# EAGLE design RollerShutterNode_rfm69 (EAGLE 6.5.0)
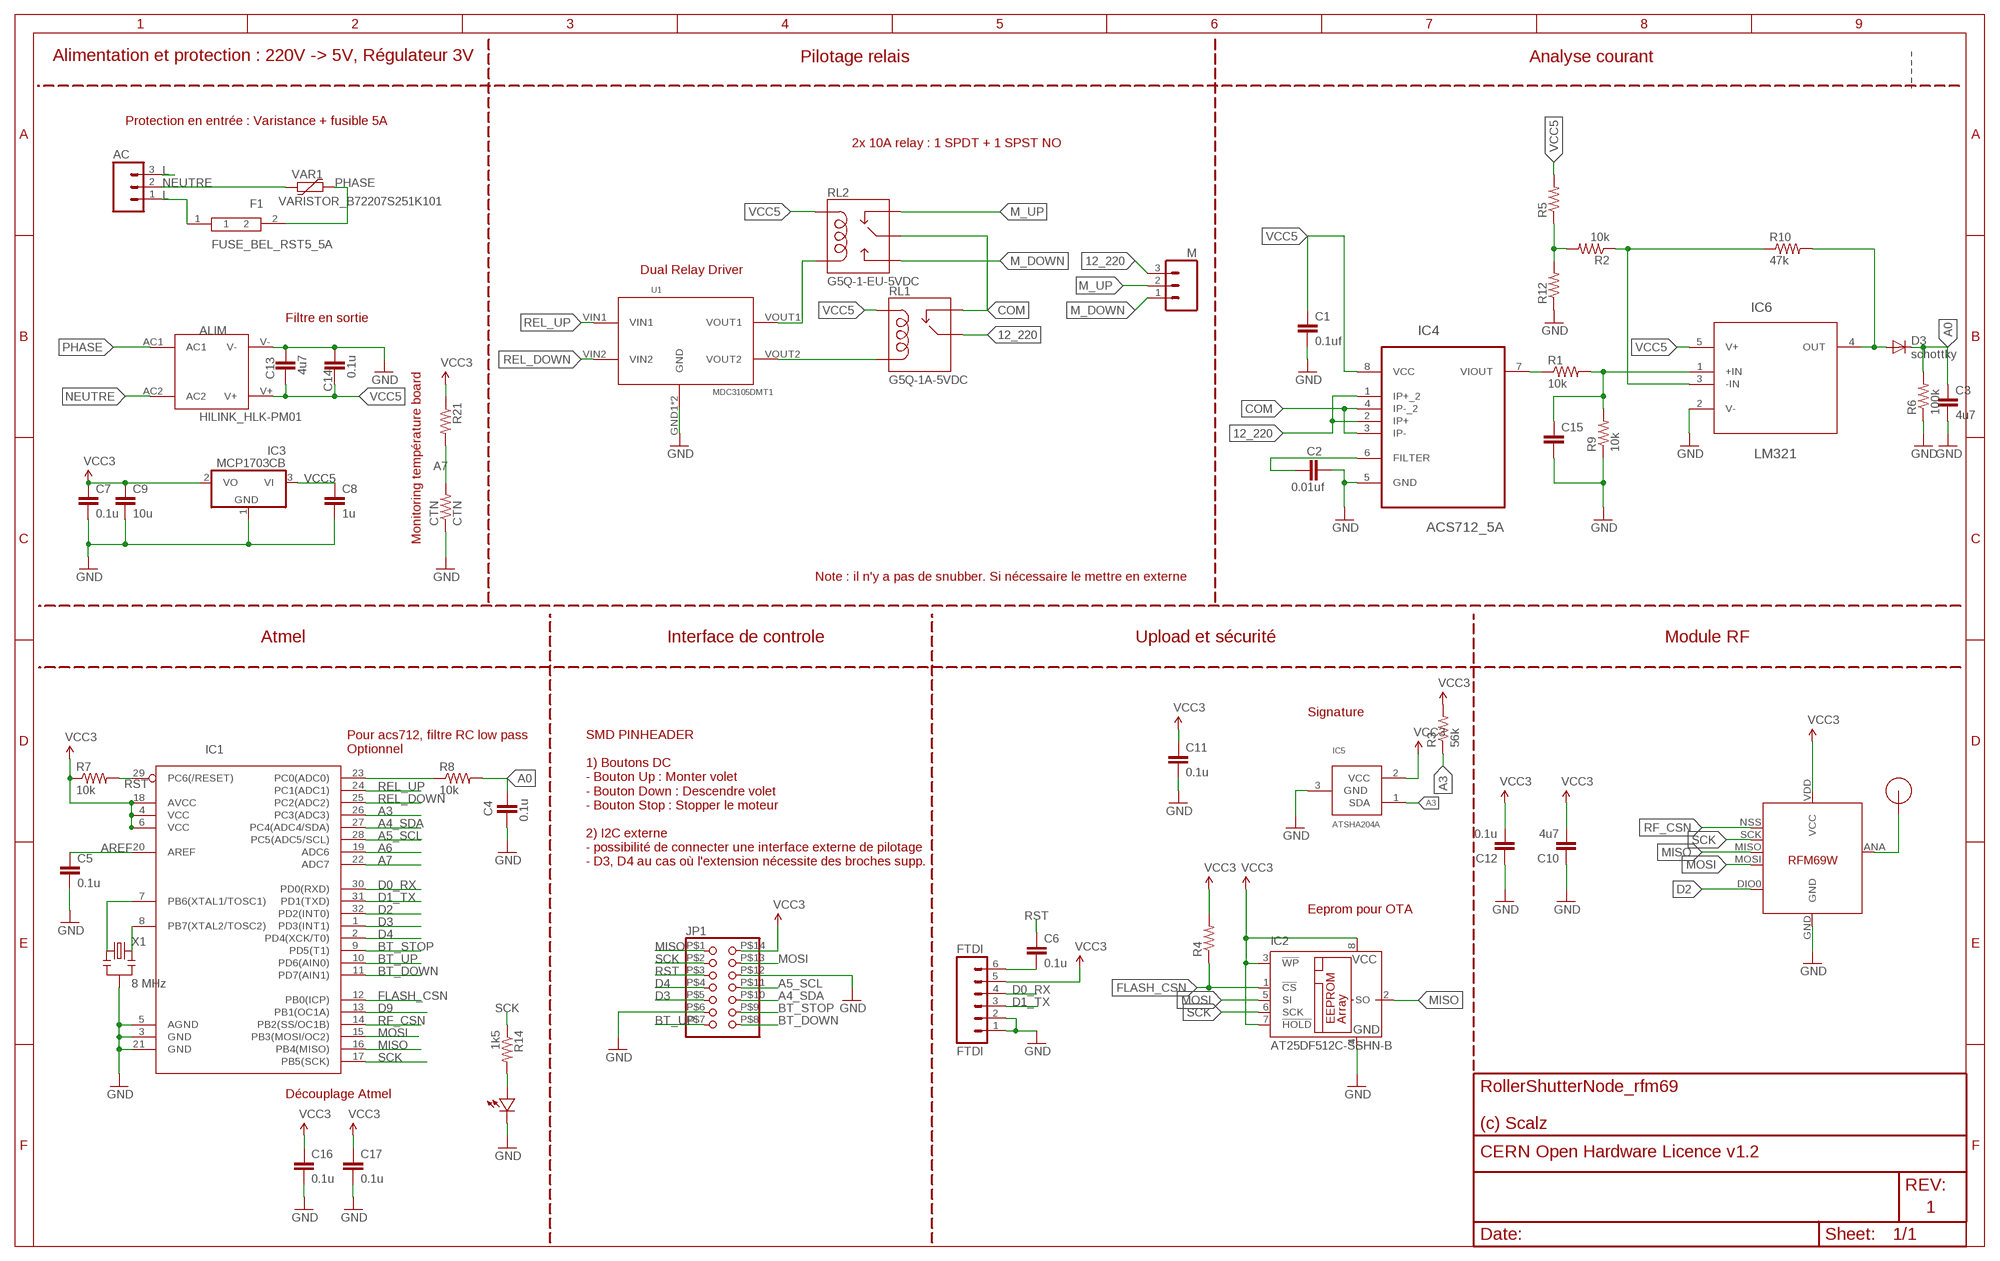
[diagram p0: schematic, sheet 1]

## Parts
AC  M03-SCREW-5MM  [SCREWTERMINAL-5MM-3]
ALIM  HILINK_HLK-PM01  [HILINK_HLK-PM01]
ANT  RFM12B_ANTENNA  [RFM12B-ANTENNA]
C1  0.1uf  CAP0805-CAP  [0805-CAP]
C2  0.01uf  CAP0805-CAP  [0805-CAP]
C3  4u7  CAP0805-CAP  [0805-CAP]
C4  0.1u  CAP0805-CAP  [0805-CAP]
C5  0.1u  CAP0805-CAP  [0805-CAP]
C6  0.1u  CAP0805-CAP  [0805-CAP]
C7  0.1u  CAP0805-CAP  [0805-CAP]
C8  1u  CAP0805-CAP  [0805-CAP]
C9  10u  CAP0805-CAP  [0805-CAP]
C10  4u7  CAP0805-CAP  [0805-CAP]
C11  0.1u  CAP0805-CAP  [0805-CAP]
C12  0.1u  CAP0805-CAP  [0805-CAP]
C13  4u7  CAP0805-CAP  [0805-CAP]
C14  0.1u  CAP0805-CAP  [0805-CAP]
C15  CAP0805-CAP  [0805-CAP]
C16  0.1u  CAP0805-CAP  [0805-CAP]
C17  0.1u  CAP0805-CAP  [0805-CAP]
CTN  CTN  RESISTOR0805-RES  [0805-RES]
D3  schottky  DIODESOD  [SOD-323]
D4  LED0805  [0805-LED]
F1  FUSE_BEL_RST5_5A  [FUSE_BEL_RST5_5A]
FTDI  FTDI  M06SIP  [1X06]
IC1  ATMega-328  ATMEGA168/328TQFP32  [TQFP32-08]
IC2  AT25DF512C-SSHN-B  25AA080SN  [SO-08]
IC3  MCP1703CB  [SOT23]
IC4  ACS712_5A  ACS712ELCTR-20A-T  [SOIC127P600X175-8N]
IC5  ATSHA204A  [SOT23]
IC6  LM321  LM321MF  [SOT95P285X120-5N]
JP1  PINHD-2X7  [2X07]
M  M03-SCREW-5MM  [SCREWTERMINAL-5MM-3]
R1  10k  RESISTOR0805-RES  [0805-RES]
R2  10k  RESISTOR0805-RES  [0805-RES]
R3  56k  RESISTOR0805-RES  [0805-RES]
R4  RESISTOR0805-RES  [0805-RES]
R5  RESISTOR0805-RES  [0805-RES]
R6  100k  RESISTOR0805-RES  [0805-RES]
R7  10k  RESISTOR0805-RES  [0805-RES]
R8  10k  RESISTOR0805-RES  [0805-RES]
R9  10k  RESISTOR0805-RES  [0805-RES]
R10  47k  RESISTOR0805-RES  [0805-RES]
R12  RESISTOR0805-RES  [0805-RES]
R14  1k5  RESISTOR0805-RES  [0805-RES]
R21  RESISTOR0805-RES  [0805-RES]
RFM69  RFM69  [RFM69W-MINPADS]
RL1  G5Q-1A-5VDC  G5Q_SINGLE  [G5Q_SINGLE]
RL2  G5Q-1-EU-5VDC  RELAYPTH  [RELAY-G5Q]
U1  MDC3105DMT1  [MDC3105DMT1]
VAR1  VARISTOR_B72207S251K101  [VARISTOR_B72207S251K101]
X1  8 MHz  RESONATORSMD  [RESONATOR-SMD]

## Nets
12_220: IC4.1(IP+_2) IC4.2(IP+) M.3 RL1.2(MAIN)
A0: C3.1 C4.2 D3.1(C) R6.2 R8.2
A3: IC1.26(PC3(ADC3)) IC5.1(SDA) R3.1
A4_SDA: IC1.27(PC4(ADC4/SDA)) JP1.P$10
A5_SCL: IC1.28(PC5(ADC5/SCL)) JP1.P$11
A6: IC1.19(ADC6)
A7: CTN.2 IC1.22(ADC7) R21.2
AREF: C5.1 IC1.20(AREF)
BT_DOWN: IC1.11(PD7(AIN1)) JP1.P$8
BT_STOP: IC1.9(PD5(T1)) JP1.P$9
BT_UP: IC1.10(PD6(AIN0)) JP1.P$7
COM: IC4.3(IP-) IC4.4(IP-_2) RL1.3(NC) RL2.2(MAIN)
D0_RX: FTDI.4 IC1.30(PD0(RXD))
D1_TX: FTDI.3 IC1.31(PD1(TXD))
D2: IC1.32(PD2(INT0)) RFM69.DIO0
D3: IC1.1(PD3(INT1)) JP1.P$5
D4: IC1.2(PD4(XCK/T0)) JP1.P$4
D9: IC1.13(PB1(OC1A))
FLASH_CSN: IC1.12(PB0(ICP)) IC2.1(!CS) R4.1
GND: ALIM.V- C1.2 C2.2 C3.2 C4.1 C5.2 C7.2 C8.2 C9.2 C10.1 C11.2 C12.1 C13.2 C14.2 C15.2 C16.2 C17.2 CTN.1 D4.MINUS FTDI.1 FTDI.2 IC1.3(GND) IC1.5(AGND) IC1.21(GND) IC2.4(GND) IC3.1(GND) IC4.5(GND) IC5.3(GND) IC6.2(V-) JP1.P$6 JP1.P$12 R6.1 R9.1 R12.1 RFM69.GND U1.GND1(GND) U1.GND2(GND) X1.2
L: AC.1 AC.3 F1.1
LM_OUT: D3.2(A) IC6.4(OUT) R10.2
M_DOWN: M.1 RL2.3(NO)
M_UP: M.2 RL2.4(NC)
MISO: IC1.16(PB4(MISO)) IC2.2(SO) JP1.P$1 RFM69.MISO
MOSI: IC1.15(PB3(MOSI/OC2)) IC2.5(SI) JP1.P$13 RFM69.MOSI
N$1: C2.1 IC4.6(FILTER)
N$3: IC4.7(VIOUT) R1.1
N$4: ANT.P$1 RFM69.ANA(ANT)
N$6: RL1.5(COIL2) U1.VOUT2
N$10: C15.1 IC6.1(+IN) R1.2 R9.2
N$11: IC6.3(-IN) R2.1 R10.1
N$12: IC1.7(PB6(XTAL1/TOSC1)) X1.1
N$16: IC1.23(PC0(ADC0)) R8.1
N$17: D4.PLUS R14.2
N$18: R2.2 R5.1 R12.2
N$19: RL2.1(COIL2) U1.VOUT1
N$20: C6.2 FTDI.6
N$21: IC1.8(PB7(XTAL2/TOSC2)) X1.3
NEUTRE: AC.2 ALIM.AC2 VAR1.1
PHASE: ALIM.AC1 F1.2 VAR1.2
REL_DOWN: IC1.25(PC2(ADC2)) U1.VIN2
REL_UP: IC1.24(PC1(ADC1)) U1.VIN1
RF_CSN: IC1.14(PB2(SS/OC1B)) RFM69.NSS(SEL)
RST: C6.1 IC1.29(PC6(/RESET)) JP1.P$3 R7.2
SCK: IC1.17(PB5(SCK)) IC2.6(SCK) JP1.P$2 R14.1 RFM69.SCK
VCC: C7.1 C9.1 C10.2 C11.1 C12.2 C16.1 C17.1 FTDI.5 IC1.4(VCC) IC1.6(VCC) IC1.18(AVCC) IC2.3(!WP) IC2.7(!HOLD) IC2.8(VCC) IC3.2(VO) IC5.2(VCC) JP1.P$14 R3.2 R4.2 R7.1 R21.1 RFM69.VDD(VCC) ; supply symbol labelled VCC3
VCC5: ALIM.V+ C1.1 C8.1 C13.1 C14.1 IC3.3(VI) IC4.8(VCC) IC6.5(V+) R5.2 RL1.1(COIL1) RL2.5(COIL1)

## Notes on the sheet
- Alimentation et protection : 220V -> 5V, Régulateur 3V | Pilotage relais | Analyse courant
- Protection en entrée : Varistance + fusible 5A
- 2x 10A relay : 1 SPDT + 1 SPST NO
- Dual Relay Driver
- Filtre en sortie
- Monitoring température board
- Note : il n'y a pas de snubber. Si nécessaire le mettre en externe
- Atmel | Interface de controle | Upload et sécurité | Module RF
- Signature
- Pour acs712, filtre RC low pass
  Optionnel
- SMD PINHEADER
  
  1) Boutons DC
  - Bouton Up : Monter volet
  - Bouton Down : Descendre volet
  - Bouton Stop : Stopper le moteur
  
  2) I2C externe
  - possibilité de connecter une interface externe de pilotage
  - D3, D4 au cas où l'extension nécessite des broches supp.
- Eeprom pour OTA
- Découplage Atmel

## Library data of the parts
AC M = SparkFun-Connectors:M03: Header 3 Standard 3-pin 0.1" header. Use with straight break away headers (SKU : PRT-00116), right angle break away headers (PRT-00553), swiss pins (PRT-00743), machine pins (PRT-00117), and female headers (PRT-00115). Molex polarized connector foot print use with SKU : PRT-08232 with associated crimp pins and housings.
ALIM = pmo_lib:HILINK_HLK-PM01
ANT = LowPowerLab:RFM12B_ANTENNA
C1-C17 = LowPowerLab:CAP: Capacitor Standard 0603 ceramic capacitor, and 0.1" leaded capacitor.
CTN R1-R10 R12 R14 R21 = LowPowerLab:RESISTOR: Resistor Basic schematic elements and footprints for 0603, 1206, and PTH resistors.
D3 = SparkFun-DiscreteSemi:DIODE: Diode These are standard reverse protection diodes and small signal diodes. SMA package can handle up to about 1A. SOD-323 can handle about 200mA. What the SOD-323 package when ordering, there are some mfgs out there that are 5-pin packages.; PROD_ID: DIO-09646
D4 = LowPowerLab:LED
F1 = pmo_lib:FUSE_BEL_RST5_5A
FTDI = SparkFun-Connectors:M06: Header 6 Standard 6-pin 0.1" header. Use with straight break away headers (SKU : PRT-00116), right angle break away headers (PRT-00553), swiss pins (PRT-00743), machine pins (PRT-00117), and female headers (PRT-00115). Molex polarized connector foot print use with SKU : PRT-08094 with associated crimp pins and housings. NOTES ON THE VARIANTS LOCK and LOCK_LONGPADS... This footprint was designed to help hold the alignment of a through-hole component (i.e. 6-pin header) while soldering it into place. You may notice that each hole has been shifted either up or down by 0.005 of an inch from it's more standard position (which is a perfectly straight line). This slight alteration caused the pins (the squares in the middle) to touch the edges of the holes. Because they are alternating, it causes a "brace" to hold the component in place. 0.005 has proven to be the perfect amount of "off-center" position when using our standard breakaway headers. Although looks a little odd when you look at the bare footprint, once you have a header in there, the alteration is very hard to notice. Also, if you push a header all the way into place, it is covered up entirely on the bottom side. This idea of altering the position of holes to aid alignment will be further integrated into the Sparkfun Library for other footprints. It can help hold any component with 3 or more connection pins.
IC1 = LowPowerLab:ATMEGA168/328: Atmel 32-pin 8-bit micro, 16k flash.; EAGLEUP: TQFP32-08
IC2 = microchip:25*: Serial EEPROM 4K/ 8K , SPI bus; MF: MICROCHIP; MPN: 25AA080/SN; OC_FARNELL: 1816072; OC_NEWARK: 92C7351
IC3 = linear:MCP1703: 250 mA, 16V, Low Quiescent Current LDO Regulator Source: http://ww1.microchip.com/downloads/en/DeviceDoc/22049b.pdf
IC4 = pmo_lib:ACS712ELCTR-20A-T: Linear Current Sensor; MPN: ACS712ELCTR-20A-T; OC_FARNELL: 1329624; OC_NEWARK: 31M3133; PACKAGE: SOIC-8; SUPPLIER: Allegro
IC5 = Sensor_tbowmo:ATSHA204A
IC6 = pmo_lib:LM321MF: Low Power Single Op Amp; MPN: LM321MF; OC_FARNELL: 9779116; OC_NEWARK: 37K8530; PACKAGE: SOT-23-5; SUPPLIER: National Semiconductors
JP1 = pmo_lib:PINHD-2X7: PIN HEADER
RFM69 = LowPowerLab:RFM69
RL1 = pmo_lib:G5Q_SINGLE
RL2 = pmo_lib:RELAY: SPDT relay (COM-00101)
U1 = pmo_lib:MDC3105DMT1
VAR1 = pmo_lib:VARISTOR_B72207S251K101
X1 = SparkFun:RESONATOR: Resonator Small SMD resonator. This is the itty bitty 10/20MHz resonators with built in caps. CSTCE10M0G55 and CSTCE20M0V53. Footprint has been reviewed closely but hasn't been tested yet.

## Net classes
1 Power: width 0.406 mm

## Board
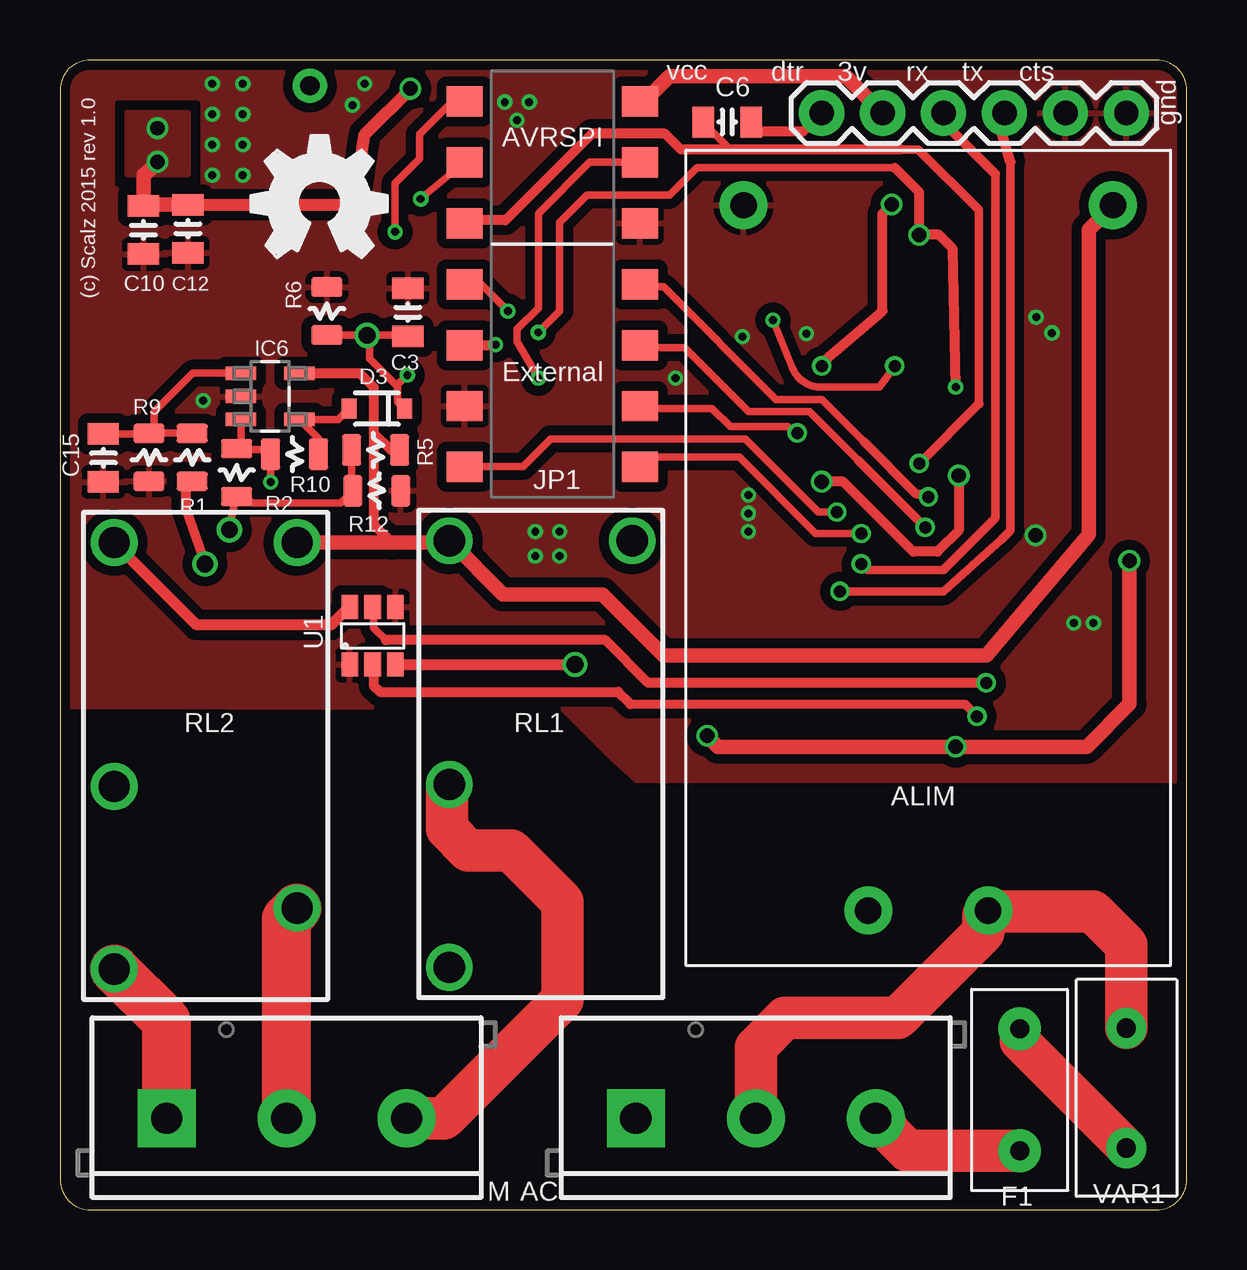
[diagram p1: board, top side]
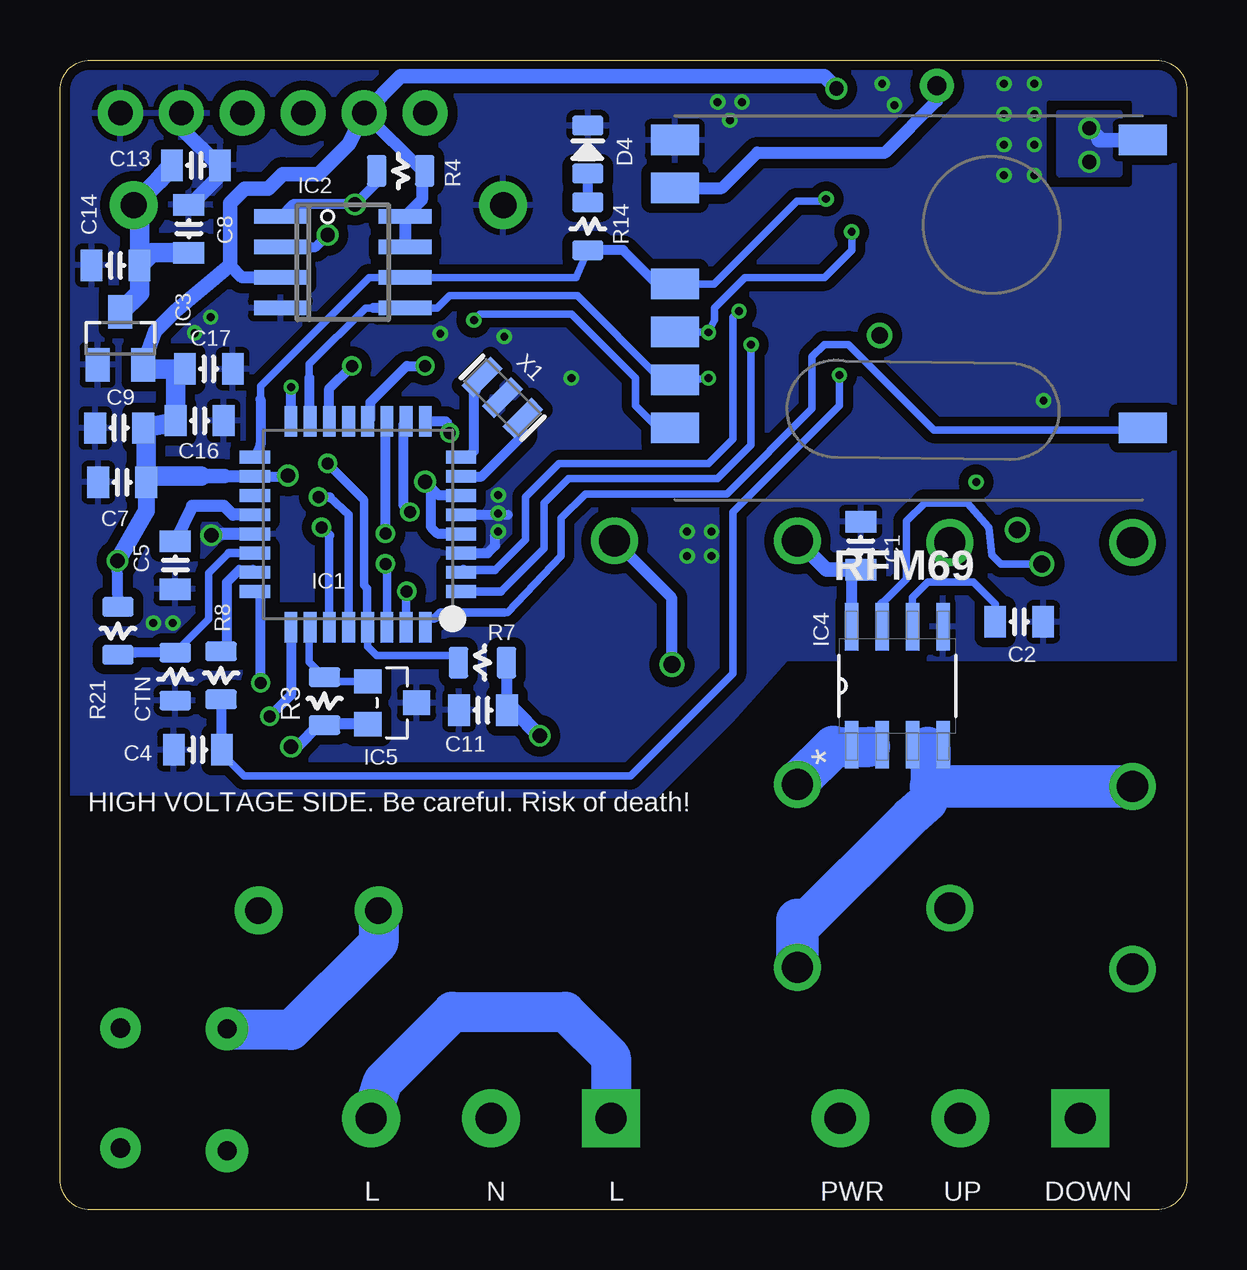
[diagram p2: board, bottom side, seen from below]

Size 46.97 x 47.93 mm. Coordinates in mm from the lower left corner, seen from the top.
Outline: 0,46.66 0,1.27 arc90 1.27,0 45.7,0 arc90 46.97,1.27 46.97,46.66 arc90 45.7,47.93 1.27,47.93 arc90 0,46.66
Copper layers (1*16): Top 0.035mm / dielectric 1.5mm / Bottom 0.035mm
Design rules "dirt_cheap_dirty_boards.v1": minimum track width 5mil, minimum drill 12mil, track to track 5mil, track to pad 5mil, pad to pad 5mil, via to via 5mil, smd to smd 0mil, copper to edge 10mil, drill to drill 10mil, minimum pad ring 10mil, minimum via ring 6mil, stop-mask expansion 2mil, vias tented up to drill 25mil, thermal gap 10mil

### Footprints (pad centres in the part's own frame; a part is rotated, then mirrored left to right if it is on the bottom)
SCREWTERMINAL-5MM-3 = drill 1.3 pad 2.413 square: 1 0,0 | drill 1.3 pad 2.413: 2 5,0; 3 10,0
HILINK_HLK-PM01 = drill 1.1 pad 2: AC1 2.5,14.7; AC2 -2.5,14.7; V+ -7.7,-14.7; V- 7.7,-14.7
RFM12B-ANTENNA = drill 0.8 pad 1.422: P$1 0,0
0805-CAP = smd 0.902 x 1.3: 1 -1,0; 2 1,0
0805-RES = smd 0.8 x 1.3: 1 -1,0; 2 1,0
SOD-323 = smd 0.63 x 0.83: 1 -1.15,0; 2 1.15,0
0805-LED = smd 0.8 x 1.3: MINUS -1,0; PLUS 1,0
FUSE_BEL_RST5_5A = drill 0.8 pad 1.778: 1 -2.54,0; 2 2.54,0
1X06 = drill 1.016 pad 1.88: 1 0,0; 2 2.54,0; 3 5.08,0; 4 7.62,0; 5 10.16,0; 6 12.7,0
TQFP32-08 = smd 1.27 x 0.533: 1 -4.293,2.8; 2 -4.293,2; 3 -4.293,1.2; 4 -4.293,0.4; 5 -4.293,-0.4; 6 -4.293,-1.2; 7 -4.293,-2; 8 -4.293,-2.8; 17 4.293,-2.8; 18 4.293,-2; 19 4.293,-1.2; 20 4.293,-0.4; 21 4.293,0.4; 22 4.293,1.2; 23 4.293,2; 24 4.293,2.8 | smd 0.533 x 1.27: 9 -2.8,-4.293; 10 -2,-4.293; 11 -1.2,-4.293; 12 -0.4,-4.293; 13 0.4,-4.293; 14 1.2,-4.293; 15 2,-4.293; 16 2.8,-4.293; 25 2.8,4.293; 26 2,4.293; 27 1.2,4.293; 28 0.4,4.293; 29 -0.4,4.293; 30 -1.2,4.293; 31 -2,4.293; 32 -2.8,4.293
SO-08 = smd 0.6 x 2.2: 1 -1.905,-2.6; 2 -0.635,-2.6; 3 0.635,-2.6; 4 1.905,-2.6; 5 1.905,2.6; 6 0.635,2.6; 7 -0.635,2.6; 8 -1.905,2.6
SOT23 = smd 1 x 1.4: 1 -0.95,-1.1; 2 0.95,-1.1; 3 0,1.1
SOIC127P600X175-8N = smd 1.981 x 0.559: 1 -2.464,1.905; 2 -2.464,0.635; 3 -2.464,-0.635; 4 -2.464,-1.905; 5 2.464,-1.905; 6 2.464,-0.635; 7 2.464,0.635; 8 2.464,1.905
SOT23' = smd 1.016 x 1.143: 1 -0.889,-1.016; 2 0.889,-1.016; 3 0,1.016
SOT95P285X120-5N = smd 1.27 x 0.559: 1 -1.219,0.965; 2 -1.219,0; 3 -1.219,-0.965; 4 1.219,-0.965; 5 1.219,0.965
2X07 = smd 1.27 x 1.5: P$1 -7.62,-3.65; P$2 -5.08,-3.65; P$3 -2.54,-3.65; P$4 0,-3.65; P$5 2.54,-3.65; P$6 5.08,-3.65; P$7 7.62,-3.65; P$8 7.62,3.65; P$9 5.08,3.65; P$10 2.54,3.65; P$11 0,3.65; P$12 -2.54,3.65; P$13 -5.08,3.65; P$14 -7.62,3.65
RFM69W-MINPADS = smd 2 x 1.27: ANA 8,-5; DIO0 -11.5,5; GND 8,-7; MISO 8,1; MOSI 8,3; NSS 8,5; SCK 8,-1; VDD -11.5,-7
G5Q_SINGLE = drill 1.3: 1 10.16,3.81; 2 0,3.81; 3 -7.62,3.81; 5 10.16,-3.81
RELAY-G5Q = drill 1.3: 1 8.89,3.81; 2 -1.27,3.81; 3 -8.89,3.81; 4 -6.35,-3.81; 5 8.89,-3.81
MDC3105DMT1 = smd 0.7 x 1: GND1 -0.95,-1.2; GND2 0.95,1.2; VIN1 0,1.2; VIN2 0,-1.2; VOUT1 -0.95,1.2; VOUT2 0.95,-1.2
VARISTOR_B72207S251K101 = drill 0.8 pad 1.676: 1 -2.5,0; 2 2.5,0
RESONATOR-SMD = smd 0.7 x 1.7: 1 -1.2,0; 2 0,0; 3 1.2,0

### Placement (x,y rotation side)
AC  24,3.81 0 top
ALIM  36.2,27.18 180 top
ANT  10.41,46.86 0 top
C1  13.59,27.69 90 bottom
C2  6.99,24.51 0 bottom
C3  14.5,37.41 90 top
C4  41.22,19.18 0 bottom
C5  42.16,26.87 270 bottom
C6  27.81,45.34 0 top
C7  44.37,30.33 180 bottom
C8  41.61,40.89 90 bottom
C9  44.5,32.59 180 bottom
C10  3.48,40.84 90 top
C11  29.34,20.83 180 bottom
C12  5.33,40.89 90 top
C13  41.3,43.54 0 bottom
C14  44.65,39.37 180 bottom
C15  1.8,31.34 270 top
C16  41.15,32.89 0 bottom
C17  40.77,35.05 0 bottom
CTN  42.16,22.23 90 bottom
D3  13.21,33.4 180 top
D4  24.97,44.2 270 bottom
F1  40.01,5 90 top
FTDI  44.45,45.72 180 top
IC1  34.54,28.57 180 bottom
IC2  35.18,39.5 270 bottom
IC3  44.45,36.32 0 bottom
IC4  12.06,21.84 90 bottom
IC5  ATSHA204A  [SOT23']  33.12,21.13 270 bottom
IC6  8.76,33.91 0 top
JP1  20.52,38.58 270 top
M  4.45,3.81 0 top
R1  5.51,31.37 90 top
R2  7.37,30.73 270 top
R3  35.94,21.21 270 bottom
R4  32.77,43.31 0 bottom
R5  13.16,31.67 0 top
R6  11.13,37.47 270 top
R7  29.36,22.81 180 bottom
R8  40.26,22.28 270 bottom
R9  3.71,31.37 90 top
R10  9.78,31.5 0 top
R12  13.21,29.97 180 top
R14  24.97,41 90 bottom
R21  44.55,24.13 270 bottom
RFM69  13.34,37.59 180 bottom
RL1  20.04,17.73 90 top
RL2  6.07,18.92 90 top
U1  13.03,23.93 0 top
U$4  [OSHW_FILLX200_NOTEXT]  7.98,39.7 0 top
VAR1  44.45,5.08 270 top
X1  28.52,33.86 135 bottom

### Tracks (layer width: path | path; a pad name or v marks a point on that pad's centre or on a via)
12_220
  Top 1.778: M.3 16,3.81 20.95,8.76 20.95,12.83 18.8,14.99 17.02,14.99 16.13,15.88 16.13,17.63 RL1.2
  Bottom 0.406: 13.21,19.3 13.26,19.38 IC4.2 IC4.1
  Bottom 1.676: 14.73,19.3 13.21,19.3
  Bottom 1.778: RL1.2 16.23,17.8 14.73,19.3
A0  (via drill 0.33 pad 0.64, 0.7)
  Top 0.305: C3.1 14.45,36.47 12.82,36.47 v12.8,36.45 | 14.08,34.31 12.9,35.48 12.9,36.35 v12.8,36.45 | R6.2 12.79,36.47 v12.8,36.45 | 14.08,34.31 14.08,33.68 D3.1 | 14.08,34.31 14.08,34.4 v14.48,34.8
  Bottom 0.305: C4.2 40.22,19.02 39.29,18.09 23.19,18.09 18.92,22.35 18.92,29.08 14.48,33.53 v14.48,34.8
  Bottom 0.406: R8.2 40.26,19.21 C4.2
A3
  Bottom 0.305: IC5.1 35.75,22.02 R3.1 36.58,22.84 36.58,24.25
  Bottom 0.406: 36.58,24.25 IC1.26 36.55,24.28
A4_SDA  (via drill 0.5)
  Top 0.305: 33.27,31.24 31.24,33.27 28.7,33.27 26.04,35.94 24.27,35.94 JP1.P$10
  Top 0.381: 33.27,31.24 v36.07,28.45
  Bottom 0.356: IC1.27 35.74,28.12
  Bottom 0.406: 35.74,28.12 v36.07,28.45
A5_SCL  (via drill 0.5)
  Top 0.305: 33.53,32 31.75,33.78 29.84,33.78 25.15,38.48 24.27,38.48 JP1.P$11
  Top 0.381: 33.53,32 35.69,29.84 36.07,29.84
  Top 0.406: 36.07,29.84 v36.2,29.72
  Bottom 0.356: IC1.28 34.94,28.98 35.71,29.69
  Bottom 0.406: 35.71,29.69 v36.2,29.72
A7
  Bottom 0.305: 39.94,27.38 40.77,26.54 40.77,24.62 CTN.2
  Bottom 0.356: IC1.22 39.94,27.38
  Bottom 0.406: CTN.2 43.85,23.23 R21.2
AREF
  Bottom 0.508: IC1.20 39.77,28.98 40.13,29.34 41.46,29.34 C5.1
BT_DOWN  (via drill 0.5)
  Top 0.305: v33.4,28.19 31.5,28.19 28.32,31.37 24.58,31.37 JP1.P$8
  Bottom 0.406: v33.4,28.19 33.4,32.81 IC1.11
BT_STOP  (via drill 0.5)
  Top 0.305: 24.66,33.02 24.52,33.16 | 24.52,33.16 JP1.P$9 | v30.73,32.38 30.61,32.38 30.35,32.64 27.94,32.64 27.18,33.4 24.77,33.4 24.52,33.16
  Top 0.406: 24.33,33.66 JP1.P$9
  Bottom 0.406: IC1.9 30.89,32.87 v30.73,32.38
BT_UP  (via drill 0.5)
  Top 0.305: v32.38,29.08 31.62,29.08 28.57,32.13 20.45,32.13 19.3,30.99 16.9,30.99 JP1.P$7
  Bottom 0.406: IC1.10 32.64,32.77 32.64,29.34 v32.38,29.08
COM
  Bottom 0.406: IC4.3 10.87,19.38 10.79,19.3 | IC4.4 10.34,19.38 10.67,19.05
  Bottom 1.676: 16.23,11.68 11.53,16.38 10.79,17.02 10.67,17.65 10.67,19.05 10.67,19.18 10.79,19.3
  Bottom 1.778: RL1.3 16.23,11.68 16.23,12.09 | RL2.2 10.67,17.65
D0_RX  (via drill 0.5)
  Top 0.356: 38.99,43.18 38.99,28.83 36.83,26.67 33.66,26.67 v33.4,26.92
  Top 0.406: 38.99,43.18 36.96,45.21 36.96,45.59 FTDI.4
  Bottom 0.356: IC1.30 33.34,26.87
  Bottom 0.406: 33.34,26.87 v33.4,26.92
D1_TX  (via drill 0.5)
  Top 0.356: v32.51,25.78 36.83,25.78 39.24,27.94 39.62,28.32 39.62,43.69
  Top 0.406: 39.62,43.69 39.24,44.96 39.24,45.72 FTDI.3
  Bottom 0.356: IC1.31 32.54,25.69
  Bottom 0.406: 32.54,25.69 v32.51,25.78
D2
  Bottom 0.305: 28.45,24.89 28.32,24.89 26.09,27.25 26.09,28.83 25.07,29.84 19.18,29.84 15.62,33.4 15.62,35.56 15.11,36.07 14.1,36.07 10.54,32.51 2.42,32.51 RFM69.DIO0
  Bottom 0.356: 31.74,24.64 31.36,24.64 31.11,24.89 28.45,24.89
  Bottom 0.406: IC1.32 31.74,24.64
D3  (via drill 0.33 pad 0.64)
  Top 0.406: JP1.P$5 18.26,36.04 v18.16,36.07
  Bottom 0.305: 28.57,25.78 26.8,27.56 26.8,29.46 25.78,30.48 19.56,30.48 18.16,31.88 v18.16,36.07
  Bottom 0.356: 28.57,25.78 IC1.1
  Bottom 0.406: IC1.1
D4  (via drill 0.33 pad 0.64)
  Top 0.305: JP1.P$4 17.55,38.58 v18.67,37.47
  Bottom 0.305: 28.83,26.67 27.56,27.94 27.56,29.72 26.16,31.11 19.94,31.11 18.92,32.13 18.92,37.21 v18.67,37.47
  Bottom 0.356: 28.83,26.67 30.16,26.67
  Bottom 0.406: 30.16,26.67 IC1.2
D9
  Bottom 0.406: 34.92,32.89 IC1.13
FLASH_CSN  (via drill 0.5, 0.6)
  Top 0.406: v31.75,35.18 31.75,35.31 34.29,37.47 34.29,41.53 v34.67,41.91
  Bottom 0.406: IC1.12 34.04,32.98 34.04,33.66 32.51,35.18 v31.75,35.18 | R4.1 33.77,42.81 v34.67,41.91 37.27,41.91 IC2.1
GND  (via drill 0.33 pad 0.64, 0.6)
  Bottom 0.305: RFM69.GND
  Bottom 0.406: IC1.5 28.3,28.98 | IC1.3 29.14,27.38 28.83,27.69 28.83,28.14 v28.7,28.27
  Bottom 0.508: IC1.21 40.71,28.18 v40.66,28.12
  Bottom 0.61: FTDI.2 41.91,45.09 40.36,43.54 C13.2 40.44,43.4 40.44,42.98 41.52,41.89 C8.2
  other vias: 28.7,29.79 28.7,29.03 5.97,33.73 19.81,28.27 20.83,28.27 19.81,27.25 20.83,27.25 28.45,36.4 31.11,36.53 40.69,37.21 41.35,36.55 25.65,34.67 42.27,24.46 43.08,24.46 6.35,46.94 6.35,45.67 6.35,44.4 6.35,43.13 7.62,43.13 7.62,44.4 7.62,45.67 7.62,46.94 12.7,46.94 12.19,46.05 19.56,46.18 18.54,46.18 19.05,45.42
  pour Top (isolate 0.406, rank 6): 1.27,47.93 45.7,47.93 arc-90 46.97,46.66 46.97,1.27 arc-90 45.7,0 1.27,0 arc-90 0,1.27 0,46.66 arc-90
  pour Bottom (isolate 0.406, rank 6): 1.27,47.93 45.7,47.93 arc-90 46.97,46.66 46.97,1.27 arc-90 45.7,0 1.27,0 arc-90 0,1.27 0,46.66 arc-90
L
  Top 1.778: F1.1 35.35,2.46 AC.3
  Bottom 1.676: AC.3 33.49,5.37 30.61,8.26 25.91,8.26 24,6.35 AC.1
LM_OUT
  Top 0.305: R10.2 10.78,32.15 IC6.4 11.6,32.94 D3.2
M_DOWN
  Top 2.032: M.1 4.45,7.85 RL2.3
M_UP
  Top 2.032: M.2 9.45,12.14 RL2.4
MISO  (via drill 0.33 pad 0.64, 0.6)
  Top 0.305: 34.8,43.43 26.54,43.43 25.4,42.29 21.97,42.29 20.83,41.15 20.83,37.47 v19.94,36.58 | v13.97,40.77 13.97,42.8 14.99,43.81 14.99,44.83 16.13,45.97 16.64,45.97 JP1.P$1
  Top 0.406: v37.34,34.29 37.21,40.06 36.64,40.64 v35.81,40.64 35.81,42.42 34.8,43.43
  Bottom 0.305: RFM69.MISO 20.18,36.59 v19.94,36.58 19.68,37.08 19.68,37.59 18.41,38.86 15.11,38.86 13.97,40.01 v13.97,40.77
  Bottom 0.406: IC1.16 37.34,33.91 v37.34,34.29 | IC2.2 36.32,40.13 v35.81,40.64
MOSI  (via drill 0.33 pad 0.64)
  Top 0.305: JP1.P$13 22.07,43.66 19.94,41.53 19.94,37.59 19.05,36.7 19.05,36.2 v19.94,34.67
  Bottom 0.305: IC2.5 31.24,37.59 30.73,38.1 25.4,38.1 21.97,34.67 21.41,34.67 RFM69.MOSI 20.65,34.59 v19.94,34.67 | 33.9,37.59 34.24,37.59 36.58,35.26 36.58,34.67
  Bottom 0.406: IC2.5 33.9,37.59 | 36.58,34.67 36.58,32.9 IC1.15
N$1
  Bottom 0.305: C2.1 7.99,25.26 8.89,26.16 10.79,26.16 11.43,25.53 IC4.6
N$2
  cutout Top (no thermals): 0,17.78 46.97,17.78 46.97,1.27 arc-90 45.7,0 1.27,0 arc-90 0,1.27
N$3  (via drill 0.7)
  Top 0.406: v6.04,26.92 5.26,29.16 5.26,30.11 R1.1
  Bottom 0.305: v6.04,26.92 7.75,26.92 8.13,27.3 8.26,28.45 9.14,29.46 10.92,29.46 11.68,28.7 11.68,26.29 12.7,25.27
  Bottom 0.406: IC4.7 12.7,25.27
N$4
  Bottom 0.508: RFM69.ANA 19.38,42.59 17.91,44.07 12.57,44.07 10.41,46.23 ANT.P$1
N$5
  cutout Top: 25.4,16.51 22.86,18.8 20.83,20.83 13.72,20.83 0.15,20.88 1.27,16.51
N$6  (via drill 0.7)
  Top 0.457: U1.VOUT2 v21.46,22.73
  Bottom 0.457: v21.46,22.73 21.46,25.5 RL1.5
N$7
  cutout Bottom: 0.25,22.86 16.64,22.86 18.92,20.32 22.61,16.64 0.25,16.64
N$10
  Top 0.305: C15.1 3.89,32.34 R9.2 | R9.2 R1.2 | IC6.1 5.54,34.87 3.94,33.27 3.94,32.39 R9.2
N$11  (via drill 0.33 pad 0.64)
  Top 0.305: IC6.3 7.54,31.91 | 7.54,31.91 R2.1 | 7.54,31.91 7.54,31.7 8.58,31.7 R10.1 v8.78,30.34
N$12
  Bottom 0.406: IC1.7 29.39,30.57 27.69,32.28 27.69,32.87 X1.1
N$13
  cutout Bottom (rank 2, no thermals): 0,17.02 46.97,17.27 46.97,1.27 arc-90 45.7,0 1.27,0 arc-90 0,1.27
N$16
  Bottom 0.406: R8.1 40.26,23.37 40.01,23.62 40.01,26.16 39.5,26.67 38.93,26.67 IC1.23
N$17
  Bottom 0.406: R14.2 D4.PLUS
N$18  (via drill 0.7)
  Top 0.305: R5.1 12.16,30.02 R12.2 11.7,29.46 8,29.46 7.73,29.73 R2.2 7.32,29.68 v7.06,28.35
N$19
  Top 0.457: U1.VOUT1 12.05,25.13 11.3,24.38 5.69,24.38 RL2.1
N$20
  Top 0.406: C6.2 28.81,45.23 29.08,44.96 30.99,44.96 FTDI.6
N$21
  Bottom 0.406: IC1.8 29.97,31.38 29.72,31.62 29.72,33.98 X1.3
NEUTRE
  Top 1.778: AC.2 29,6.78 30.23,8 34.92,8 38.48,11.56 38.48,12.26 ALIM.AC2 38.73,12.45 43.05,12.45 44.45,11.05 VAR1.1
PHASE
  Top 1.676: F1.2 40.01,7.03 VAR1.2
  Bottom 1.676: ALIM.AC1 33.7,11.14 37.34,7.49 39.95,7.49 F1.2
REL_DOWN  (via drill 0.5)
  Top 0.381: 23.77,21.08 37.72,21.08 v38.23,20.57
  Top 0.406: U1.VIN2 13.08,22.68 13.08,21.84 13.34,21.59 23.27,21.59 23.77,21.08
  Bottom 0.406: IC1.25 37.34,21.46 v38.23,20.57
REL_UP  (via drill 0.5)
  Top 0.305: 12.83,25.18 U1.VIN1 13.08,25.08 13.08,24.26 13.59,23.75
  Top 0.406: v38.61,21.97 24.51,21.97 22.73,23.75 13.59,23.75
  Bottom 0.406: v38.61,21.97 38.61,25.55 IC1.24
RF_CSN  (via drill 0.33 pad 0.64, 0.5)
  Top 0.305: v34.8,35.18 34.16,34.29 31.71,34.29 arc-68 30.54,35.08 v29.72,37.08
  Bottom 0.305: RFM69.NSS 22.05,32.59 22.99,33.53 22.99,34.67 25.65,37.34 29.46,37.34 v29.72,37.08
  Bottom 0.406: IC1.14 35.74,34.23 v34.8,35.18
RST  (via drill 0.5)
  Top 0.305: C6.1 26.81,45.32 27.94,44.2
  Top 0.356: 38.3,33.6 38.3,41.68 35.79,44.2 35.05,44.2
  Top 0.381: v35.81,31.11 38.3,33.6
  Top 0.406: 35.05,44.2 27.94,44.2 25.88,44.2 25.22,44.86 22.17,44.86 18.57,41.25 17,41.25 JP1.P$3
  Bottom 0.305: IC1.29 34.14,23.48 33.78,23.11 30.54,23.11 R7.2
  Bottom 0.356: 34.16,24.26 34.16,25.91 34.29,26.04 34.29,29.59 v35.81,31.11
  Bottom 0.406: 34.16,24.26 IC1.29
SCK  (via drill 0.33 pad 0.64)
  Top 0.305: JP1.P$2 v15.04,42.14
  Bottom 0.305: R14.1 25.47,38.86 IC2.6 34.09,38.86 38.61,34.34 38.61,33.78 | RFM69.SCK 19.7,38.59 16.26,42.04 15.14,42.04 v15.04,42.14
  Bottom 0.406: 38.61,33.78 38.61,31.91 IC1.17 38.86,31.4 | RFM69.SCK 22.08,38.59 23.5,40.01 24.96,40.01 R14.1
VCC  (via drill 0.6)
  Top 0.406: v37.47,30.61 37.47,28.32 36.58,27.43 35.56,27.43 32.64,30.35 v31.75,30.35
  Top 0.508: C12.2 11.92,41.89 12.32,42.29 12.7,44.83 v14.61,46.74
  Top 0.61: JP1.P$14 24.36,46.2 25.4,47.24 32.77,47.24 FTDI.5 | v26.98,19.76 27.43,19.3 v37.34,19.3 42.8,19.3 44.58,21.08 v44.58,27.05 | v4.06,43.69 3.53,43.16 3.48,43.16 C10.2 3.53,41.89 C12.2
  Bottom 0.406: IC1.18 37.5,30.57 v37.47,30.61 | IC1.6 31.17,29.77 v31.75,30.35 31.5,29.97 31.5,28.45 31.24,28.19 30.27,28.19 IC1.4
  Bottom 0.457: C11.1 28.34,22.91 R7.1 | IC5.2 35.91,20.24 R3.2 36.18,20.21 37.08,19.3 v37.34,19.3 | R21.1 v44.58,27.05
  Bottom 0.508: IC1.18 40.1,30.57 40.11,30.58 | R4.2 31.88,43.31 | 31.88,43.31 FTDI.5 | 31.88,43.31 31.88,42.1 IC2.8 IC2.7 | IC2.3 39.37,38.86 39.88,39.37
  Bottom 0.61: 40.11,30.58 41.09,30.58 | IC3.2 42.99,36.64 42.16,37.47 39.88,39.37 39.88,41.96 39.27,42.57 38.3,42.57 37.69,43.18 36.2,43.18 34.92,44.45 FTDI.5 32.77,47.24 15.11,47.24 v14.61,46.74 | C11.1 28.04,20.83 v26.98,19.76 | RFM69.VDD 3.67,44.59 3.67,44.69 v4.06,45.09
  Bottom 0.711: C7.1 43.37,29.14 v44.58,27.05
  Bottom 0.813: 41.09,30.58 43.25,30.58 C7.1 43.37,32.72 C9.1 42.2,32.84 C16.1 42.15,34.67 C17.1 43.33,35.05 IC3.2
  pour Bottom: 2.79,45.72 5.33,45.72 5.33,43.18 2.79,43.18
  pour Top: 2.79,45.72 2.79,43.18 5.33,43.18 5.33,45.72
VCC5
  Top 0.305: 16.15,27.81 RL1.1
  Top 0.406: IC6.5 12.5,34.87 13.08,34.29 13.08,32.38 | 13.08,32.38 13.08,28.57 13.84,27.81 | R5.2 13.79,31.67 13.08,32.38
  Top 0.61: RL1.1 18.47,25.65 22.61,25.65 25.15,23.11 38.61,23.11 42.88,28.15 42.88,40.86 ALIM.V+ | 16.15,27.81 13.84,27.81 RL2.5
  Bottom 0.457: IC4.8 13.97,26.3 C1.1
  Bottom 0.61: C1.1 15.03,26.69 RL1.1
  Bottom 0.813: 43.94,41.96 ALIM.V+ | C13.1 42.86,42.91 ALIM.V+ | C14.1 43.65,41.64 ALIM.V+ | C14.1 43.65,38.22 IC3.3 | C8.1 43.13,39.89 C14.1

### Text on the board
tPlace: vcc | dtr | 3v | rx | tx | cts | gnd | (c) Scalz 2015 rev 1.0 | AVRSPI | External
bPlace: HIGH VOLTAGE SIDE. Be careful. Risk of death! | DOWN | UP | PWR | L | N | L